# Altium schematic sheet Symmetric_PS.SchDoc
size A4; Organization: Altium Limited; Address1: L3, 12a Rodborough Rd; Address2: Frenchs Forest; Address3: NSW; Address4: Australia 2086; DocumentNumber: 6; SheetNumber: 6; SheetTotal: 19
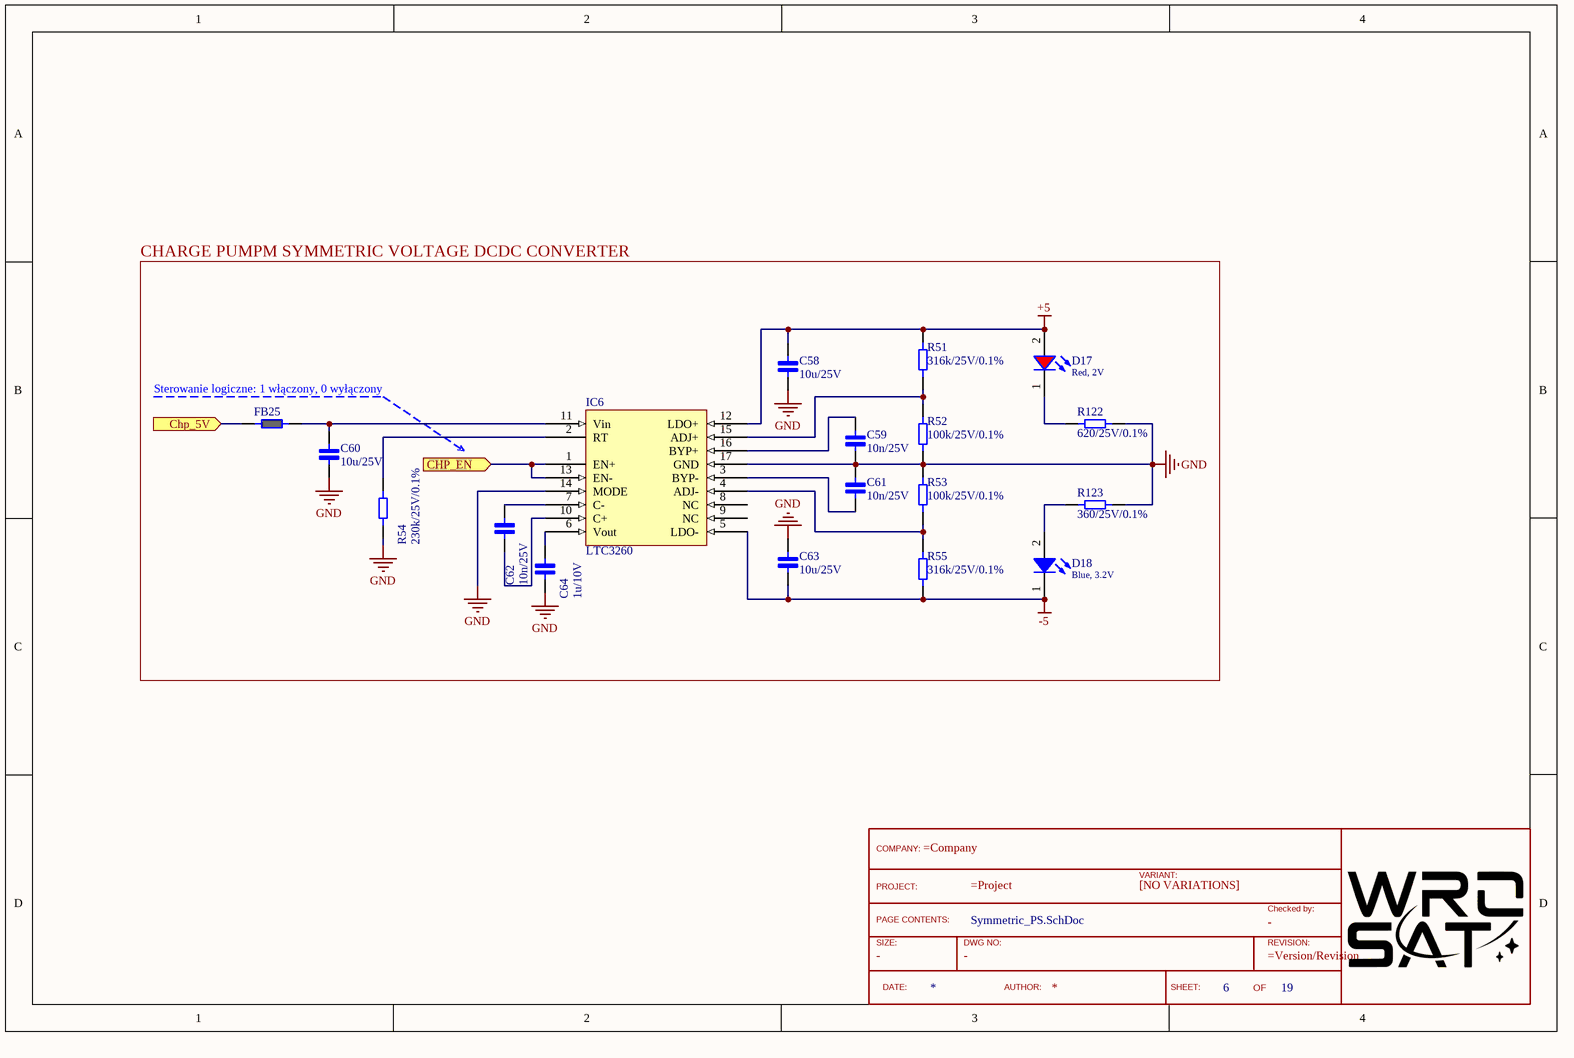
[diagram p0: Symmetric_PS.SchDoc]

## Parts
?  TitleBlock  (value not drawn)  (graphical)
C58  10u/25V  [CAP_0805]
C59  10n/25V  [Cap_0402]
C60  10u/25V  [CAP_0805]
C61  10n/25V  [Cap_0402]
C62  10n/25V  [Cap_0402]
C63  10u/25V  [CAP_0805]
C64  1u/10V  [Cap_0402]
D17  Red, 2V  [WL-SMCW_0603_H=0.7mm]
D18  Blue, 3.2V  [WL-SMCW_0603_H=0.7mm]
FB25  Ferrite_bead_0402  [FERRITE_0402]  (value not drawn)
IC6  LTC3260  [MSOP-16]
R51  316k/25V/0.1%  [RES_0402]
R52  100k/25V/0.1%  [RES_0402]
R53  100k/25V/0.1%  [RES_0402]
R54  230k/25V/0.1%  [RES_0402]
R55  316k/25V/0.1%  [RES_0402]
R122  620/25V/0.1%  [RES_0402]
R123  360/25V/0.1%  [RES_0402]

## Blocks framed on the sheet
CHARGE PUMPM SYMMETRIC VOLTAGE DCDC CONVERTER: C58-C64 D17 D18 FB25 IC6 R51-R55 R122 R123

## Ports
Chp_5V (in), CHP_EN (in)

## Nets
+5: C58.2 D17.2(A) IC6.12(LDO+) R51.2
-5: C63.1 D18.1(K) IC6.5(LDO-) R55.1
GND: C58.1 C59.1 C60.1 C61.2 C63.2 C64.1 IC6.14(MODE) IC6.17(GND) R52.1 R53.2 R54.1 R122.1 R123.2
Chp_5V: FB25.1 ; port Chp_5V
CHP_EN: IC6.1(EN+) IC6.13(EN-) ; port CHP_EN
NetC59_2: C59.2 IC6.16(BYP+)
NetC60_2: C60.2 FB25.2 IC6.11(Vin)
NetC61_1: C61.1 IC6.3(BYP-)
NetC62_1: C62.1 IC6.10(C+)
NetC62_2: C62.2 IC6.7(C-)
NetC64_2: C64.2 IC6.6(Vout)
NetD17_1: D17.1(K) R122.2
NetD18_2: D18.2(A) R123.1
NetIC6_2: IC6.2(RT) R54.2
NetIC6_4: IC6.4(ADJ-) R53.1 R55.2
NetIC6_15: IC6.15(ADJ+) R51.1 R52.2

Not connected (* = marked no-connect by the designer): IC6 8(NC) 9(NC)

## Notes on the sheet
- (near FB25) Sterowanie logiczne: 1 włączony, 0 wyłączony
- Title
- Size:
- Date:
- A3
- Number:
- Time:
- Revision:
- Sheet
- of
- File:
- (in symbol TitleBlock) COMPANY:; VARIANT:; PROJECT:; [NO VARIATIONS]; Checked by:; PAGE CONTENTS:; SIZE:; DWG NO:; REVISION:; DATE:; AUTHOR:; SHEET:; OF

## Library data of the parts
? = TitleBlock: Standard TitleBlock; DrawingNo: -; Size: -; Checked: -
C58 C60 C63 = Cap_0805_10u_25v: Ceramic Capacitor 10uF / 0805 / 25V / ±5%, Wurth Elektronik MLCC
C59 C61 C62 = Cap_0402_10n: Ceramic Capacitor 10n / 0402 / 25V / ±5%, Wurth Elektronik MLCC; ComponentLink1Description: New link; ComponentLink1URL: https://www.we-online.com/catalog/en/WCAP-CSGP-25VDC
C64 = Cap_0402_1u: Ceramic Capacitor 1uF / 0402 / 10V / ±5%, Wurth Elektronik MLCC
D17 = 150060RS75000: WL-SMCW SMT Mono-color Chip LED Waterclear, size 0603, Red, 2V, 140deg; Chip Technology: AlInGaP; Dominant Wavelength typ.: 625nm; Luminous Intensity typ.: 250mcd; Peak Wavelength typ.: 630nm; Viewing Angle: 140deg; ComponentLink1Description: Manufacturer; ComponentLink1URL: http://www.we-online.de; ComponentLink2URL: https://www.we-online.com/catalog/datasheet/150060RS75000.pdf; ComponentLink2Description: Datasheet; Forward Voltage typ.: 2V; Emitting Color: Red; Mounting Technology: SMT; Operating Temperature: -40 to +85degC; Published Date: December 2019; Part Number: 150060RS75000; Packaging: Tape and Reel; Size: 0603; Publisher: Wurth Elektronik
D18 = 150060BS75000: WL-SMCW SMT Mono-color Chip LED Waterclear, size 0603, Blue, 3.2V, 140deg; Chip Technology: InGaN; Dominant Wavelength typ.: 470nm; Luminous Intensity typ.: 145mcd; Peak Wavelength typ.: 465nm; Viewing Angle: 140deg; ComponentLink1Description: Manufacturer; ComponentLink1URL: http://www.we-online.de; ComponentLink2URL: https://www.we-online.com/catalog/datasheet/150060BS75000.pdf; ComponentLink2Description: Datasheet; Forward Voltage typ.: 3.2V; Emitting Color: Blue; Mounting Technology: SMT; Operating Temperature: -40 to +85degC; Published Date: December 2019; Part Number: 150060BS75000; Packaging: Tape and Reel; Size: 0603; Publisher: Wurth Elektronik
FB25 = Ferrite_bead_0402: Ferrite bead, wurth 74269241102
IC6 = LTC3260: Charge pump, low noise; ComponentLink1Description: New link; ComponentLink1URL: https://pl.mouser.com/datasheet/2/609/3260fa-1271271.pdf
R51 R55 = Res_0402_316k: Vishay, thin film resistor 316k/25V/0.1%
R52 R53 = Res_0402_100k: Vishay, thin film resistor 100k/25V/0.1%
R54 = Res_0402_230k: Vishay, thin film resistor 230k/25V/0.1%
R122 R123 = Res_0402_1: Vishay, thin film resistor 1/25V/0.1%